# EAGLE design Dual Motor Driver (EAGLE 6.5.0)
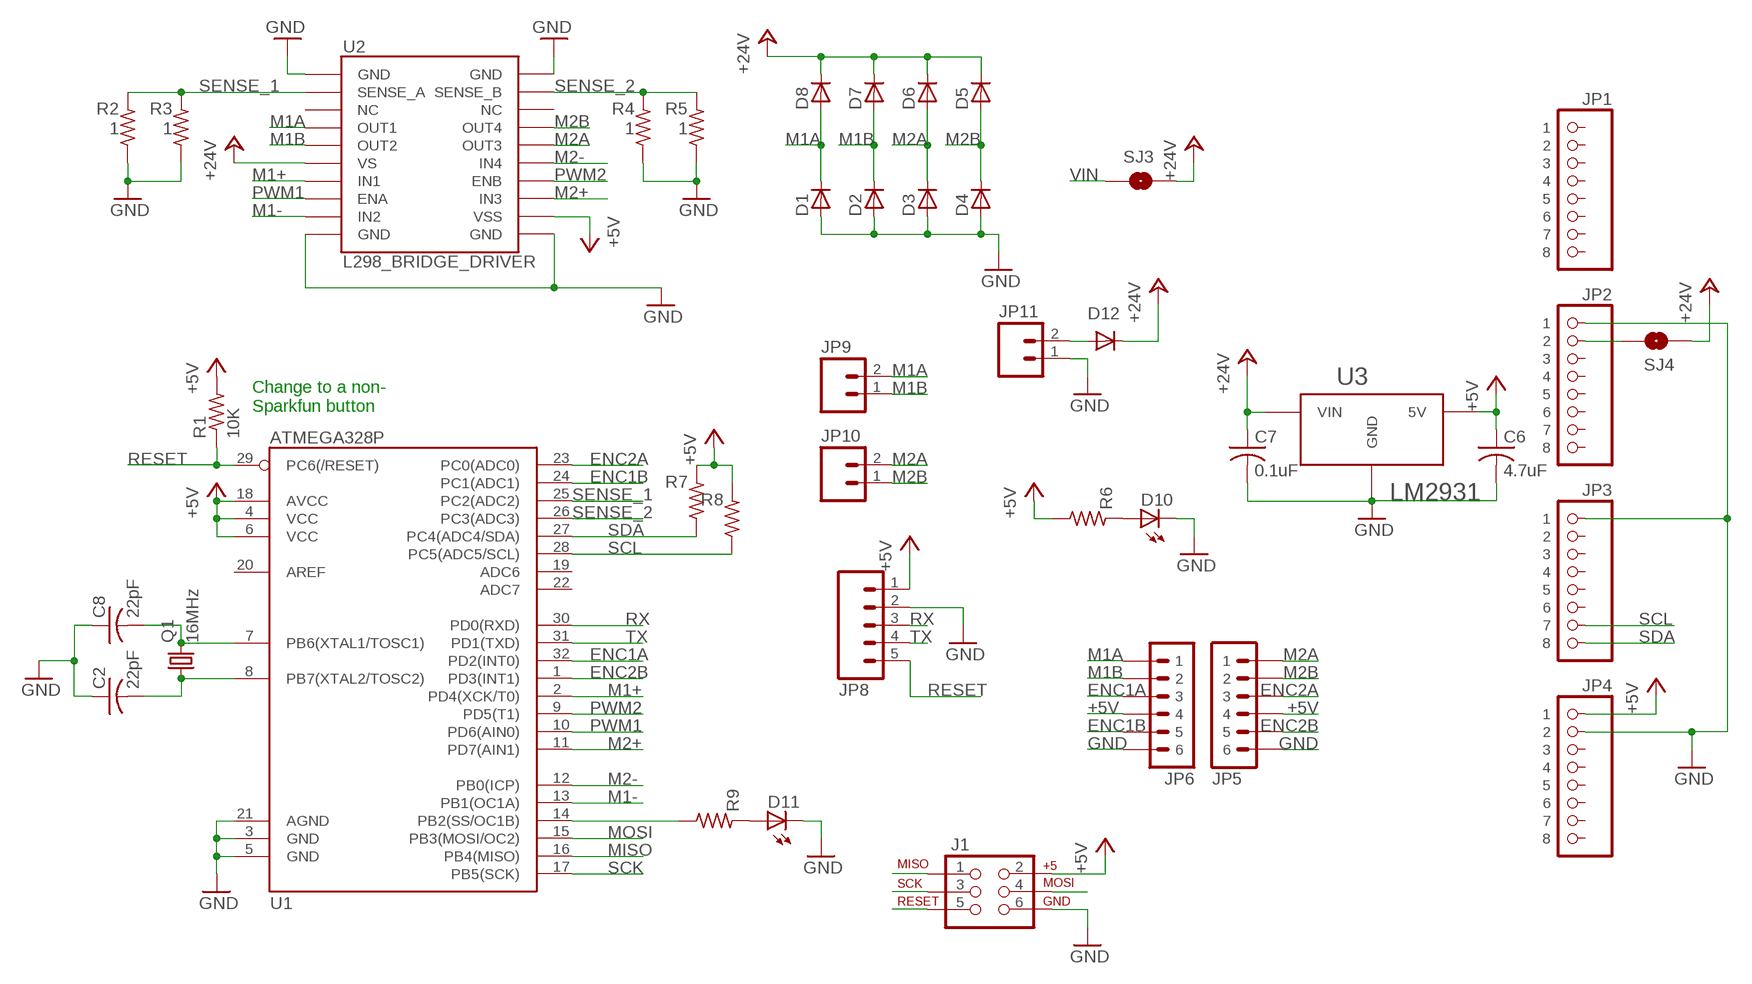
[diagram p0: schematic, sheet 1]

## Parts
C2  22pF  C-USC0603  [C0603]
C6  4.7uF  C-USC0603  [C0603]
C7  0.1uF  C-USC0603  [C0603]
C8  22pF  C-USC0603  [C0603]
D1  D-SOD123  [SOD123]
D2  D-SOD123  [SOD123]
D3  D-SOD123  [SOD123]
D4  D-SOD123  [SOD123]
D5  D-SOD123  [SOD123]
D6  D-SOD123  [SOD123]
D7  D-SOD123  [SOD123]
D8  D-SOD123  [SOD123]
D10  LED-GREENLED-0805_NO_SILK  [LED-0805]
D11  LED-GREENLED-0805_NO_SILK  [LED-0805]
D12  DIODESMB  [SMB-DIODE]
J1  AVR_SPI_PRG_62X3_LOCK  [2X3_LOCK]
JP1  8-PIN_HEADER  [8-PIN_RECEPTACLE_LOCK_NO-SS]
JP2  8-PIN_HEADER  [8-PIN_RECEPTACLE_LOCK_NO-SS]
JP3  8-PIN_HEADER  [8-PIN_RECEPTACLE_LOCK_NO-SS]
JP4  8-PIN_HEADER  [8-PIN_RECEPTACLE_LOCK_NO-SS]
JP5  6PIN-SH_RIGHT_ANGLE  [6PIN-SH_SERIES_RA]
JP6  6PIN-SH_RIGHT_ANGLE  [6PIN-SH_SERIES_RA]
JP8  M05PTH  [1X05]
JP9  M02PTH  [1X02]
JP10  M02PTH  [1X02]
JP11  M02PTH  [1X02]
Q1  16MHz  CRYSTALCTS406  [CTS406]
R1  10K  R-US_R0603  [R0603]
R2  1  R-US_R0603  [R0603]
R3  1  R-US_R0603  [R0603]
R4  1  R-US_R0603  [R0603]
R5  1  R-US_R0603  [R0603]
R6  R-US_R0603  [R0603]
R7  R-US_R0603  [R0603]
R8  R-US_R0603  [R0603]
R9  R-US_R0603  [R0603]
SJ3  SOLDERJUMPERNC  [SJ_2S]
SJ4  SOLDERJUMPERTRACE  [SJ_2S-TRACE]
U1  ATMEGA328P  ATMEGA328_SMT  [TQFP32-08]
U2  L298_BRIDGE_DRIVER  [POWERSO20]
U3  LM2931  [TO263]

## Nets
+5V: C6.1 J1.2 JP4.P$1 JP5.P$4 JP6.P$4 JP8.1 R1.2 R6.1 R7.2 R8.2 U1.4(VCC) U1.6(VCC) U1.18(AVCC) U2.12(VSS) U3.P$3(5V)
+24V: C7.1 D5.1(C) D6.1(C) D7.1(C) D8.1(C) D12.C SJ3.2 SJ4.1 U2.6(VS) U3.P$2(VIN)
ENC1A: JP6.P$3 U1.32(PD2(INT0))
ENC1B: JP6.P$5 U1.24(PC1(ADC1))
ENC2A: JP5.P$3 U1.23(PC0(ADC0))
ENC2B: JP5.P$5 U1.1(PD3(INT1))
GND: C2.1 C6.2 C7.2 C8.1 D1.2(A) D2.2(A) D3.2(A) D4.2(A) D10.2(C) D11.2(C) J1.6 JP2.P$1 JP3.P$1 JP4.P$2 JP5.P$6 JP6.P$6 JP8.2 JP11.1 R2.1 R3.1 R4.1 R5.1 U1.3(GND) U1.5(GND) U1.21(AGND) U2.1(GND) U2.10(GND) U2.11(GND) U2.20(GND) U3.P$1(GND)
M1+: U1.2(PD4(XCK/T0)) U2.7(IN1)
M1-: U1.13(PB1(OC1A)) U2.9(IN2)
M1A: D1.1(C) D8.2(A) JP6.P$1 JP9.2 U2.4(OUT1)
M1B: D2.1(C) D7.2(A) JP6.P$2 JP9.1 U2.5(OUT2)
M2+: U1.11(PD7(AIN1)) U2.13(IN3)
M2-: U1.12(PB0(ICP)) U2.15(IN4)
M2A: D3.1(C) D6.2(A) JP5.P$1 JP10.2 U2.16(OUT3)
M2B: D4.1(C) D5.2(A) JP5.P$2 JP10.1 U2.17(OUT4)
MISO: J1.1 U1.16(PB4(MISO))
MOSI: J1.4 U1.15(PB3(MOSI/OC2))
N$1: D10.1(A) R6.2
N$2: D11.1(A) R9.2
N$4: R9.1 U1.14(PB2(SS/OC1B))
N$5: JP2.P$2 SJ4.2
N$6: C8.2 Q1.3 U1.7(PB6(XTAL1/TOSC1))
N$7: C2.2 Q1.1 U1.8(PB7(XTAL2/TOSC2))
PWM1: U1.10(PD6(AIN0)) U2.8(ENA)
PWM2: U1.9(PD5(T1)) U2.14(ENB)
RESET: J1.5 JP8.5 R1.1 U1.29(PC6(/RESET))
RX: JP8.3 U1.30(PD0(RXD))
SCK: J1.3 U1.17(PB5(SCK))
SCL: JP3.P$7 R8.1 U1.28(PC5(ADC5/SCL))
SDA: JP3.P$8 R7.1 U1.27(PC4(ADC4/SDA))
SENSE_1: R2.2 R3.2 U1.25(PC2(ADC2)) U2.2(SENSE_A)
SENSE_2: R4.2 R5.2 U1.26(PC3(ADC3)) U2.19(SENSE_B)
TX: JP8.4 U1.31(PD1(TXD))
VIN: D12.A JP11.2 SJ3.1
Unconnected: JP1.P$1 JP1.P$2 JP1.P$3 JP1.P$4 JP1.P$5 JP1.P$6 JP1.P$7 JP1.P$8 JP2.P$3 JP2.P$4 JP2.P$5 JP2.P$6 JP2.P$7 JP2.P$8 JP3.P$2 JP3.P$3 JP3.P$4 JP3.P$5 JP3.P$6 JP4.P$3 JP4.P$4 JP4.P$5 JP4.P$6 JP4.P$7 JP4.P$8 U1.19(ADC6) U1.20(AREF) U1.22(ADC7) U2.3(NC) U2.18(NC)

## Notes on the sheet
- Change to a non-
  Sparkfun button

## Library data of the parts
C2 C6-C8 = resistor:C-US: CAPACITOR, American symbol
D1-D8 = semicon-smd-ipc:D-: DIODE unfilled; PART#: CDBW140-G
D10 D11 = SparkFun-LED:LED-GREEN: Various green LEDs 0603- DIO-00821 LARGE- DIO-00862 LILYPAD- DIO-09910
D12 = SparkFun-DiscreteSemi:DIODE: Diode These are standard reverse protection diodes and small signal diodes. SMA package can handle up to about 1A. SOD-323 can handle about 200mA. What the SOD-323 package when ordering, there are some mfgs out there that are 5-pin packages.
J1 = SparkFun-Connectors:AVR_SPI_PRG_6: AVR ISP 6 Pin This is the reduced ISP connector for AVR programming. Common on Arduino. This footprint will take up less PCB space and can be used with a 10-pin to 6-pin adapter such as SKU: BOB-08508
JP1-JP4 = My Parts:8-PIN_HEADER
JP5 JP6 = con-jst:6PIN-SH; PART#: SM06B-SRSS-TB(LF)(SN)
JP8 = SparkFun-Connectors:M05: Header 5 Standard 5-pin 0.1" header. Use with straight break away headers (SKU : PRT-00116), right angle break away headers (PRT-00553), swiss pins (PRT-00743), machine pins (PRT-00117), and female headers (PRT-00115). Molex polarized connector foot print use with SKU : PRT-08230 with associated crimp pins and housings.
JP9-JP11 = SparkFun-Connectors:M02: Header 2 Standard 2-pin 0.1" header. Use with straight break away headers (SKU : PRT-00116), right angle break away headers (PRT-00553), swiss pins (PRT-00743), machine pins (PRT-00117), and female headers (PRT-00115). Molex polarized connector foot print use with SKU : PRT-08233 with associated crimp pins and housings.
Q1 = crystal:CRYSTAL: CRYSTAL; OC_FARNELL: unknown; OC_NEWARK: unknown; PART#: 406C35D16M00000
R1-R9 = resistor:R-US_: RESISTOR, American symbol
SJ3 SJ4 = SparkFun-Passives:SOLDERJUMPER: Solder Jumper Standard SMD solder jumper. Used to automate production. Two varients : Normally Open and Normally Closed are the same, but have different paste layers. NC will have a large amount of paste and should jumper during reflow.
U1 = SparkFun-DigitalIC:ATMEGA328_SMT: 32-Pin Atmega328 part Commonly used on Arduino compatible boards Available in QFP and QFN packages TQFP is IC-09069 QFN is non-stock; PROD_ID: IC-09069
U2 = SparkFun-PowerIC:L298_BRIDGE_DRIVER: Full-bridge power driver IC
U3 = on-semiconductor:LM2931

## Board
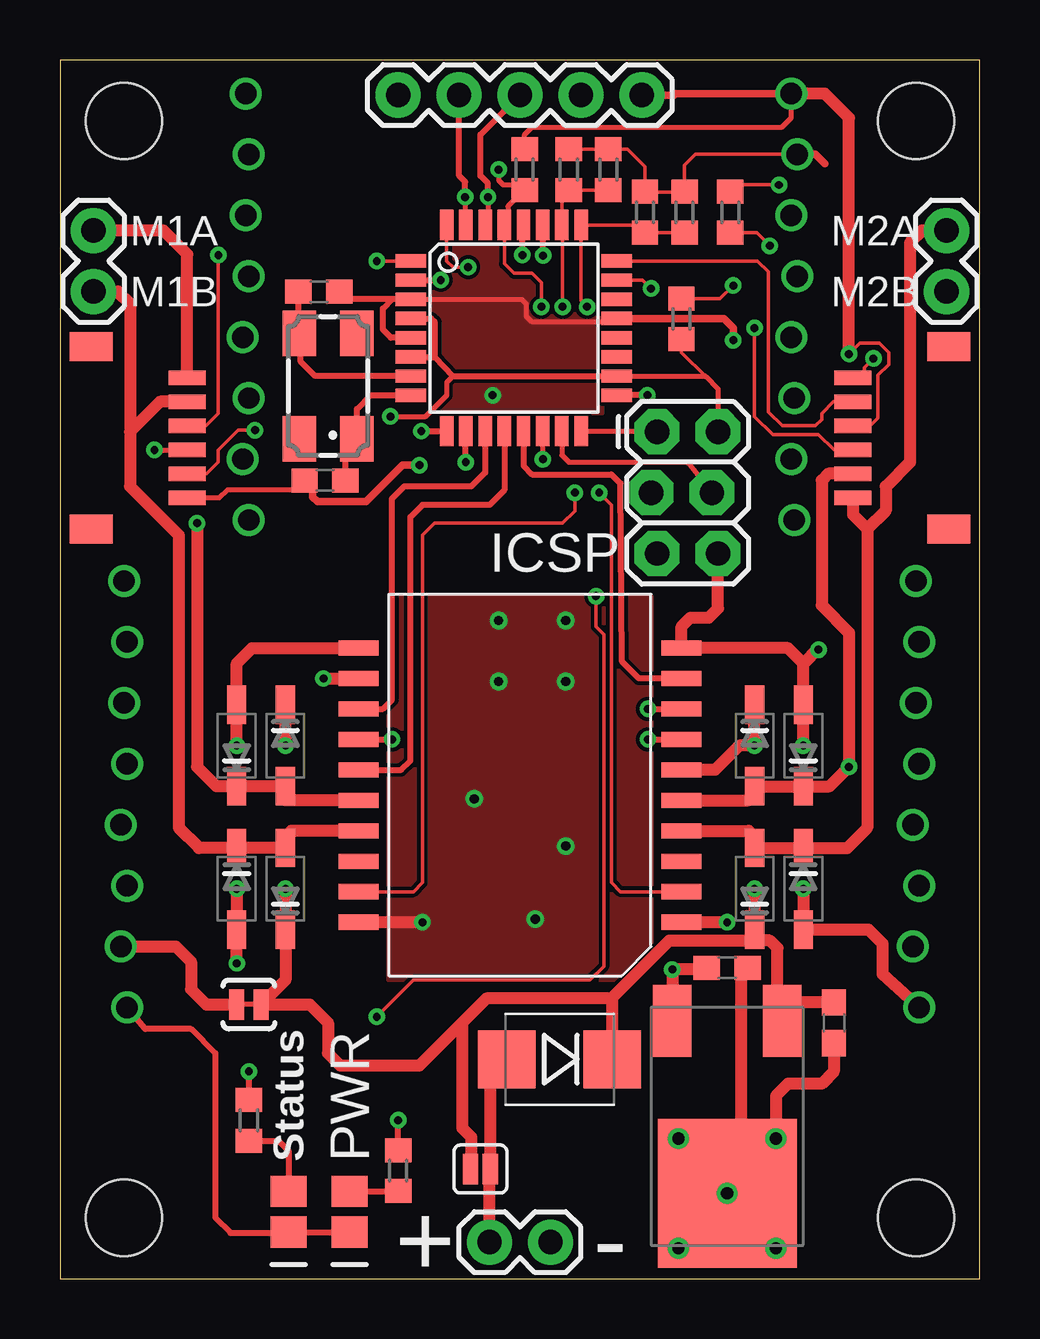
[diagram p1: board, top side]
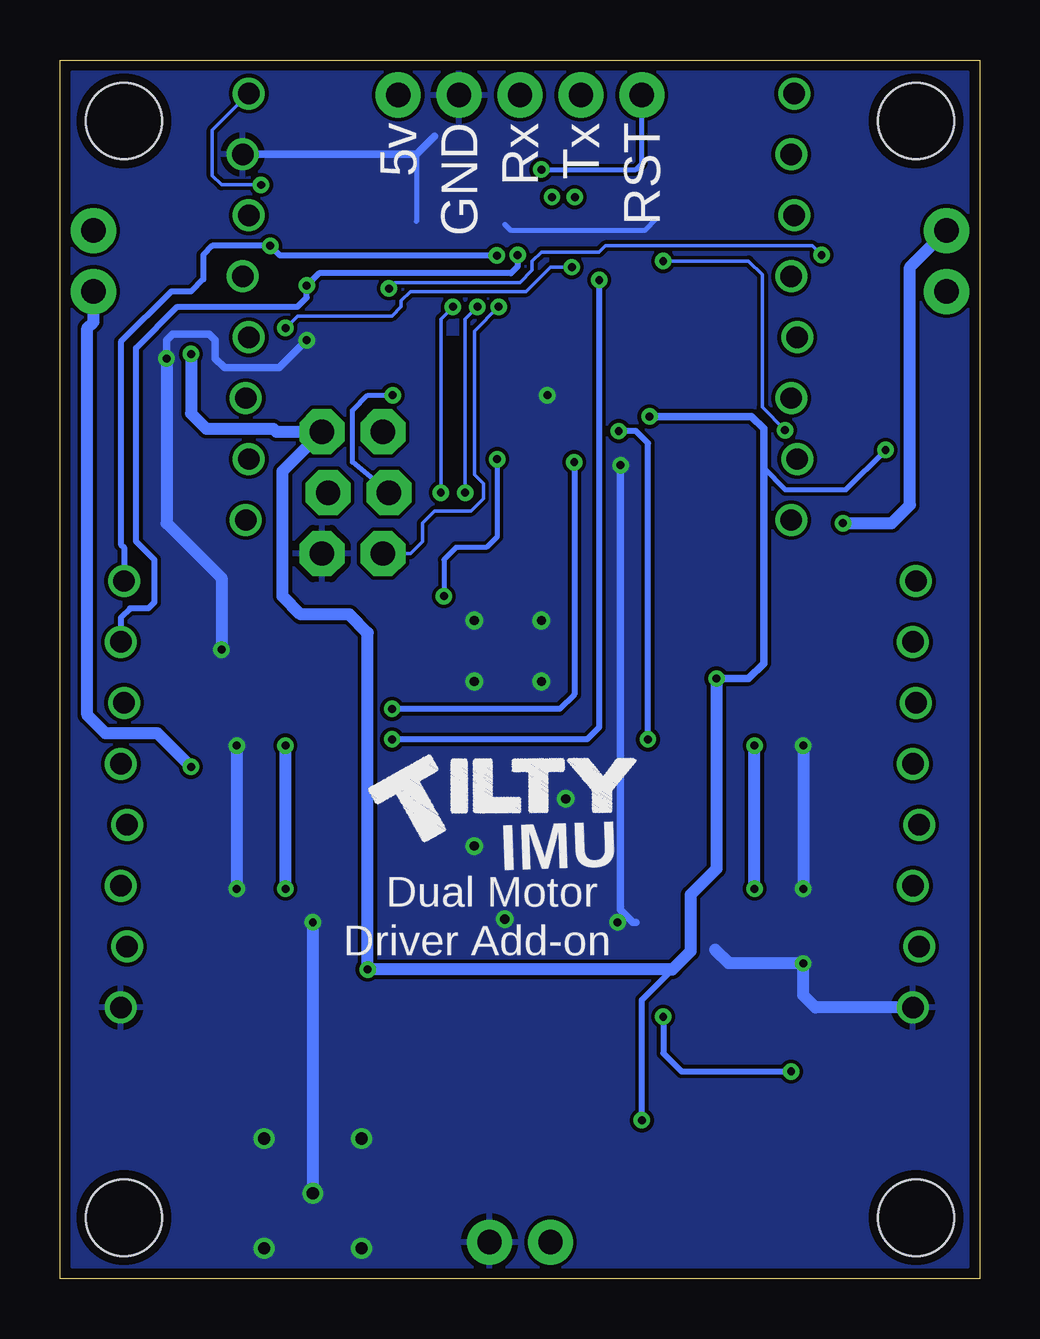
[diagram p2: board, bottom side, seen from below]

Size 38.35 x 50.8 mm. Coordinates in mm from the lower left corner, seen from the top.
Outline: 0,0 38.35,0 38.35,50.8 0,50.8 0,0
Copper layers (1*16): Top 0.0356mm / dielectric 1.5011mm / Bottom 0.0356mm
Design rules "LaenPCBOrder": minimum track width 6mil, minimum drill 13mil, track to track 6mil, track to pad 6mil, pad to pad 6mil, via to via 6mil, smd to smd 6mil, copper to edge 15mil, drill to drill 6mil, minimum pad ring 7mil, minimum via ring 7mil, stop-mask expansion 4mil, vias tented up to drill 0mil, thermal gap 10mil
Holes 3.17 mm at 2.67,2.54 35.69,2.54 35.69,48.26 2.67,48.26

### Footprints (pad centres in the part's own frame; a part is rotated, then mirrored left to right if it is on the bottom)
C0603 = smd 1.1 x 1: 1 -0.85,0; 2 0.85,0
SOD123 = smd 1.6 x 0.8: 1 -1.7,0; 2 1.7,0
LED-0805 = smd 1.3 x 1.5: 1 -0.85,0; 2 0.85,0
SMB-DIODE = smd 2.4 x 2.4: A 2.2,0; C -2.2,0
2X3_LOCK = drill 1.016 pad 1.88 octagon: 1 0,0; 2 0,2.54; 3 2.54,-0.254; 4 2.54,2.286; 5 5.08,0; 6 5.08,2.54
8-PIN_RECEPTACLE_LOCK_NO-SS = drill 0.889: P$1 -8.89,-0.127; P$2 -6.35,0.127; P$3 -3.81,-0.127; P$4 -1.27,0.127; P$5 1.27,-0.127; P$6 3.81,0; P$7 6.35,-0.127; P$8 8.89,0
6PIN-SH_SERIES_RA = smd 0.6 x 1.55: P$1 -2.5,2.125; P$2 -1.5,2.125; P$3 -0.5,2.125; P$4 0.5,2.125; P$5 1.5,2.125; P$6 2.5,2.125 | smd 1.2 x 1.8: P$7 3.8,-1.875; P$8 -3.8,-1.875
1X05 = drill 1.016 pad 1.88: 1 0,0; 2 2.54,0; 3 5.08,0; 4 7.62,0; 5 10.16,0
1X02 = drill 1.016 pad 1.88: 1 0,0; 2 2.54,0
CTS406 = smd 1.9 x 1.4: 1 -2.2,-1.2; 2 2.2,-1.2; 3 2.2,1.2; 4 -2.2,1.2
R0603 = smd 1 x 1.1: 1 -0.85,0; 2 0.85,0
SJ_2S = smd 0.635 x 1.27: 1 -0.412,0; 2 0.412,0
SJ_2S-TRACE = smd 0.635 x 1.27: 1 -0.508,0; 2 0.508,0
TQFP32-08 = smd 1.27 x 0.559: 1 -4.293,2.8; 2 -4.293,2; 3 -4.293,1.2; 4 -4.293,0.4; 5 -4.293,-0.4; 6 -4.293,-1.2; 7 -4.293,-2; 8 -4.293,-2.8; 17 4.293,-2.8; 18 4.293,-2; 19 4.293,-1.2; 20 4.293,-0.4; 21 4.293,0.4; 22 4.293,1.2; 23 4.293,2; 24 4.293,2.8 | smd 0.559 x 1.27: 9 -2.8,-4.293; 10 -2,-4.293; 11 -1.2,-4.293; 12 -0.4,-4.293; 13 0.4,-4.293; 14 1.2,-4.293; 15 2,-4.293; 16 2.8,-4.293; 25 2.8,4.293; 26 2,4.293; 27 1.2,4.293; 28 0.4,4.293; 29 -0.4,4.293; 30 -1.2,4.293; 31 -2,4.293; 32 -2.8,4.293
POWERSO20 = smd 1.651 x 0.635: 1 -6.731,5.715; 2 -6.731,4.445; 3 -6.731,3.175; 4 -6.731,1.905; 5 -6.731,0.635; 6 -6.731,-0.635; 7 -6.731,-1.905; 8 -6.731,-3.175; 9 -6.731,-4.445; 10 -6.731,-5.715; 11 6.731,-5.715; 12 6.731,-4.445; 13 6.731,-3.175; 14 6.731,-1.905; 15 6.731,-0.635; 16 6.731,0.635; 17 6.731,1.905; 18 6.731,3.175; 19 6.731,4.445; 20 6.731,5.715
TO263 = smd 5.791 x 6.198: P$1 0,2.794 | smd 1.6 x 2.997: P$2 -2.286,-4.394; P$3 2.286,-4.394

### Placement (x,y rotation side)
C2  11.05,33.27 0 top
C6  27.81,12.95 0 top
C7  32.26,10.67 270 top
C8  10.79,41.15 180 top
D1  30.99,16.26 270 top
D2  30.99,22.23 90 top
D3  7.37,22.23 90 top
D4  7.37,16.26 270 top
D5  9.4,16.26 90 top
D6  9.4,22.23 270 top
D7  28.96,22.23 270 top
D8  28.96,16.26 90 top
D10  12.06,2.79 270 top
D11  9.53,2.79 270 top
D12  20.83,9.14 180 top
J1  24.89,35.31 270 top
JP1  7.75,40.51 90 top
JP2  2.67,20.19 90 top
JP3  35.69,20.19 90 top
JP4  30.61,40.51 270 top
JP5  3.18,35.05 270 top
JP6  35.18,35.05 90 top
JP8  24.26,49.34 180 top
JP9  36.96,41.15 90 top
JP10  1.4,41.15 90 top
JP11  20.45,1.52 180 top
Q1  11.18,37.21 90 top
R1  19.37,46.23 90 top
R2  24.38,44.45 270 top
R3  26.04,44.45 270 top
R4  22.86,46.23 270 top
R5  21.21,46.23 270 top
R6  14.1,4.51 270 top
R7  27.94,44.45 90 top
R8  25.91,40.01 270 top
R9  7.87,6.6 270 top
SJ3  17.53,4.57 180 top
SJ4  7.87,11.43 180 top
U1  18.92,39.62 0 top
U2  19.18,20.57 180 top
U3  27.81,6.35 180 top

### Tracks (layer width: path | path; a pad name or v marks a point on that pad's centre or on a via)
+5V  (via drill 0.33)
  Top 0.152: R8.2 25.91,38.61 26.92,37.59 | v29.97,45.59 28.23,45.59 R7.2 | v32.89,38.54 33.34,38.99 34.16,38.99 34.54,38.61 34.54,38.1 34.1,37.66 34.1,35.88 33.78,35.56 33.06,35.56 JP6.P$4
  Top 0.203: U1.18 26.89,37.62 26.92,37.59 27.43,37.08 J1.2 | v13.78,35.94 15.24,35.94 16.13,36.83 16.13,37.36 16.38,37.62 | R1.2 19.37,47.69 19.68,48.01 30.1,48.01 30.48,48.39 JP4.P$1 | v3.94,34.54 5.3,34.54 JP5.P$4
  Top 0.254: U1.6 15.63,38.42 | 15.63,38.42 16.38,37.62 23.21,37.62 U1.18 | U1.4 15.47,40.02 15.63,39.87 15.63,38.42 | U3.P$3 25.53,11.18 26.04,11.68 | R6.1 v14.1,6.6
  Top 0.318: JP4.P$1 25.65,49.4 25.59,49.34 JP8.1
  Top 0.508: U3.P$3 v25.53,12.89 25.55,12.91 26.92,12.91 C6.1 | v32.89,38.54 32.89,48.39 31.88,49.4 JP4.P$1 | v10.99,25.02 U2.12
  Bottom 0.152: v29.97,45.59 31.62,45.59 32,45.97 32,47.88 JP4.P$1
  Bottom 0.203: 9.02,35.43 9.02,33.78 8.13,32.89 5.59,32.89 v3.94,34.54
  Bottom 0.254: v14.1,6.6 14.1,11.62 12.73,12.99
  Bottom 0.318: v13.78,35.94 9.53,35.94 9.02,35.43 9.02,25.65 9.65,25.02 v10.99,25.02
  Bottom 0.508: v32.89,38.54 32.89,36.07 32.26,35.43 29.46,35.43 29.34,35.31 J1.2 29.08,33.66 29.08,28.45 28.32,27.69 26.29,27.69 25.53,26.92 v25.53,12.89 12.83,12.89 12.73,12.99 12.06,13.65 12.06,16 10.99,17.08 v10.99,25.02
+24V  (via drill 0.33)
  Top 0.508: v9.4,22.23 D6.1 | v9.4,16.26 D5.1 9.4,12.45 SJ4.1 10.41,11.43 11.18,10.67 11.18,9.4 11.68,8.89 14.99,8.89 16.76,10.67 | v28.96,16.26 D8.1 | D7.1 v28.96,22.23 28.32,22.23 27.3,21.21 U2.6 | D8.1 28.96,14.1 | 28.96,14.1 25.4,14.1 23.03,11.72 D12.C 23.03,11.52 22.86,11.68 17.78,11.68 16.76,10.67 | 28.96,14.1 29.02,14.03 | 29.02,14.03 29.02,14.49 D8.1 | 30.1,11.43 30.1,11.68 30.11,11.69 30.11,11.93 29.91,12.13 29.91,13.78 29.59,14.1 29.08,14.1 29.02,14.03 | 30.1,11.43 U3.P$2 30.05,10.79 | 17.08,4.61 SJ3.2 17.14,4.6 17.14,5.91 16.76,6.29 16.76,10.67 | C7.1 30.19,11.52 30.1,11.43
  Bottom 0.508: v9.4,16.26 v9.4,22.23 | v28.96,16.26 v28.96,22.23
ENC1A  (via drill 0.33)
  Top 0.152: JP6.P$3 32.25,34.55 31.62,35.18 29.72,35.18 28.96,35.94 v28.96,39.62 | U1.32 16.12,42.42 16.38,42.16 v17.02,42.16
  Bottom 0.152: v28.96,39.62 28.45,40.13 24.51,40.13 24.13,40.51 24.13,40.77 23.75,41.15 18.92,41.15 17.91,42.16 v17.02,42.16
ENC1B
  Top 0.152: U1.24 29.08,42.42 29.53,41.97 29.53,36.13 30.11,35.55 30.11,35.56 31.5,35.56 31.75,35.81 31.75,36.07 32.23,36.55 JP6.P$5
ENC2A  (via drill 0.33)
  Top 0.152: U1.23 24.29,41.62 v24.64,41.27 | v6.6,42.67 6.6,36.07 6.1,35.56 JP5.P$3
  Bottom 0.152: v24.64,41.27 24.38,41.53 19.18,41.53 18.67,42.04 18.67,42.42 18.29,42.8 15.88,42.8 15.62,43.05 6.99,43.05 v6.6,42.67
ENC2B  (via drill 0.33)
  Top 0.152: v13.21,42.42 U1.1 | v8.13,35.37 7.43,35.37 6.6,34.54 6.6,34.04 6.12,33.55 JP5.P$5
  Bottom 0.152: v13.21,42.42 9.65,42.42 9.08,41.85 9.08,36.32 v8.13,35.37
GND  (via drill 0.33, 0.38, 0.51)
  Top 0.152: JP4.P$2 26.48,46.86 26.04,46.42 R3.1 R2.1 24.38,46.35 23.66,47.08 R4.1 R5.1 | v33.91,38.35 33.53,37.97 33.53,37.59 33.09,37.59 JP6.P$6
  Top 0.203: U1.21 22.88,40.02 22.73,39.88 19.68,39.88 19.43,40.13 19.43,40.64 19.25,40.82 U1.3 | JP5.P$6 6.64,32.55 6.99,32.89 9.82,32.89 C2.1 | 11.43,41.36 C8.1
  Top 0.254: U1.3 13.84,40.82 | 13.84,40.82 11.84,40.82 C8.1 | U1.5 13.8,39.22 13.46,39.56 13.46,40.44 13.84,40.82 | JP2.P$1 3.56,10.41 5.46,10.41 6.48,9.4 6.48,2.54 7.11,1.91 9.49,1.91 D11.2 D10.2
  Top 0.318: U1.21 27.67,40.02 28.07,39.62 v28.07,39.12 | JP4.P$2 31.5,46.86 31.88,46.48 | v14.99,33.91 14.29,33.91 12.76,32.38 10.73,32.38 10.54,32.58 10.54,32.93 C2.1
  Top 0.508: v7.37,16.26 D4.2 v7.37,13.14 | v7.37,22.23 D3.2 7.37,25.65 8,26.29 U2.11 | v30.99,16.26 D1.2 33.7,14.56 34.29,13.97 34.29,12.7 JP3.P$1 | v30.99,22.23 D2.2 30.99,25.65 | 25.27,6.35 25.27,6.1 U3.P$1 | v29.84,1.27 29.84,1.52 U3.P$1 | v25.78,1.27 25.78,1.52 U3.P$1 | U3.P$1 25.78,5.59 v25.78,5.84 v29.84,5.84 29.84,7.62 30.35,8.13 31.75,8.13 32.26,8.64 C7.2 | v27.81,14.86 U2.1 | 30.99,25.65 30.35,26.29 U2.10 25.91,27.18 26.29,27.56 27.05,27.56 27.43,27.94 J1.6 | v15.11,14.86 U2.20 | v31.62,26.23 31.62,26.29 30.99,25.65 | C6.2 28.66,12.91 28.38,12.64 28.38,4.13 U3.P$1
  Bottom 0.203: 19.81,43.94 19.56,43.69 13.97,43.69 13.46,44.2 | 23.5,46.86 23.5,44.07
  Bottom 0.318: v28.07,39.12 29.21,37.97 31.5,37.97 31.88,38.35 31.88,39.12 32.13,39.37 33.66,39.37 33.91,39.12 v33.91,38.35 | 14.35,14.86 14.48,14.86 14.99,15.37 v14.99,33.91 | 22.73,47.62 23.5,46.86 JP4.P$2
  Bottom 0.508: v7.37,22.23 v7.37,16.26 | v30.99,22.23 v30.99,16.26 | v27.81,14.86 U3.P$1 | JP2.P$1 6.86,11.3 7.37,11.81 v7.37,13.14 10.48,13.14 11.05,13.72 | v33.91,38.35 33.91,31.5 31.62,29.21 v31.62,26.23
  other vias: 27.81,3.56 21.08,27.43 18.29,27.43 18.29,24.89 21.08,24.89 21.08,18.03 19.81,14.99 18.03,36.83 17.27,20
  pour Top: 13.72,28.45 24.64,28.45 24.64,13.72 23.62,12.45 13.72,12.45
  pour Bottom: 37.85,39.12 37.08,39.12 37.08,25.15 32.77,25.15 32.77,39.37 18.03,39.37 18.03,44.2 37.85,44.2
  pour Bottom: 17.78,39.12 17.78,43.18 17.78,44.45 23.11,39.12
  pour Bottom: 0.51,0.51 37.85,0.51 37.85,50.29 0.51,50.29
  pour Top: 15.49,43.18 22.61,43.18 22.61,36.07 15.49,36.07
M1+  (via drill 0.33)
  Top 0.254: U1.2 15.87,41.62 v15.88,41.63 | v24.51,22.48 U2.7
  Bottom 0.254: v15.88,41.63 15.88,22.99 16.38,22.48 v24.51,22.48
M1-
  Top 0.254: U2.9 24.13,25.02 23.43,25.72 23.37,33.15 22.99,33.53 19.68,33.53 19.32,33.89 U1.13
M1A
  Top 0.508: U2.4 28.7,18.67 28.83,18.54 28.83,18.08 D8.2 D1.1 32.81,17.96 33.66,18.8 33.66,31.24 | 33.66,31.24 34.42,32 34.42,33.02 35.43,34.04 35.43,43.18 35.94,43.69 JP9.2 | JP6.P$1 33.05,31.84 33.66,31.24
M1B  (via drill 0.33)
  Top 0.508: U2.5 28.7,19.94 28.83,20.07 28.83,20.4 D7.2 D2.1 32.08,20.52 v32.89,21.34 32.89,26.92 31.75,28.07 31.75,33.27 32.03,33.55 JP6.P$2
  Bottom 0.508: JP9.1 36.96,39.88 37.21,39.62 37.21,23.5 36.45,22.73 34.29,22.73 v32.89,21.34
M2+
  Top 0.254: U2.13 13.46,23.75 13.84,24.13 13.84,32.51 14.35,33.02 17.14,33.02 17.72,33.6 U1.11
M2-
  Top 0.254: U2.15 14.22,21.21 14.61,21.59 14.61,31.75 15.11,32.26 17.91,32.26 18.52,32.87 U1.12
M2A  (via drill 0.33)
  Top 0.508: U2.16 9.4,19.94 9.27,20.07 9.27,20.4 D6.2 D3.1 6.53,20.52 5.71,21.34 v5.71,31.5 | JP5.P$1 5.31,42.7 4.32,43.69 JP10.2
  Bottom 0.508: v5.71,31.5 3.68,31.5 2.92,32.26 2.92,42.16 JP10.2
M2B
  Top 0.508: U2.17 9.65,18.67 9.53,18.54 9.53,18.08 D5.2 D4.1 5.79,17.96 4.95,18.8 4.95,30.99 2.92,33.02 2.92,35.31 | JP10.1 2.41,41.15 2.92,40.64 2.92,35.31 | JP5.P$2 4.17,36.55 2.92,35.31
MISO
  Top 0.203: J1.1 21.75,35.31 U1.16
MOSI
  Top 0.203: U1.15 20.92,34.32 21.21,34.04 26.16,34.04 J1.4
N$1
  Top 0.254: D10.1 14.08,3.64 R6.2
N$2
  Top 0.254: R9.2 9.11,5.75 9.53,5.33 D11.1
N$3
  cutout Bottom: 20.07,42.67 29.21,42.67 29.59,43.05 32,43.05 32.38,42.67 32.38,41.66 32.89,41.15 33.72,41.15 35.81,39.05 35.81,30.54 35.69,30.42 35.69,27.69 35.81,27.56 35.81,26.67 35.81,27.56 35.43,27.94 34.67,27.94 34.42,28.19 34.42,29.97 35.18,30.73 35.18,38.8 33.46,40.51 28.45,40.51 28.07,40.89 28.07,41.4 27.56,41.91 19.56,41.91 19.3,42.16 19.3,42.67
N$4  (via drill 0.33)
  Top 0.152: v22.35,28.45 22.35,27.18 22.67,26.86 22.67,13.02 22.1,12.45 14.73,12.45 v13.21,10.92
  Top 0.203: v20.13,34.16 U1.14
  Top 0.254: v7.87,8.64 R9.1
  Bottom 0.203: v20.13,34.16 20.13,30.92 20.57,30.48 21.84,30.48 22.35,29.97 v22.35,28.45
  Bottom 0.254: v13.21,10.92 13.21,9.4 12.45,8.64 v7.87,8.64
N$5
  Top 0.508: JP2.P$2 4.83,13.84 5.46,13.21 5.46,12.06 6.1,11.43 SJ4.2
N$6
  Top 0.254: C8.2 9.95,39.41 Q1.3 10.03,39.35 10.03,38.23 10.64,37.62 U1.7
N$7
  Top 0.254: Q1.1 12.41,35.01 | Q1.1 12.38,36.25 12.95,36.83 U1.8 | C2.2 11.9,34.53 Q1.1
PWM1  (via drill 0.33)
  Top 0.254: v16.92,34.04 U1.10 | v24.51,23.75 U2.8
  Bottom 0.254: v16.92,34.04 16.92,24.36 17.53,23.75 v24.51,23.75
PWM2  (via drill 0.33)
  Top 0.254: v15.06,35.33 U1.9 | U2.14 v13.84,22.48
  Bottom 0.254: v13.84,22.48 13.84,34.82 14.35,35.33 v15.06,35.33
RESET  (via drill 0.33)
  Top 0.152: v20.07,40.51 20.07,41.53 19.68,41.91 18.92,41.91 18.52,42.31 U1.29
  Top 0.203: U1.29 18.67,44.06 18.67,44.7 18.92,44.96 19.18,44.96 19.37,45.15 R1.1 19.15,45.59 18.48,45.59 18.29,45.78 v18.29,46.23
  Bottom 0.152: J1.5 23.75,30.23 23.24,30.73 23.24,31.5 22.73,32 21.21,32 20.7,32.51 20.7,33.15 21.08,33.53 21.08,39.5 v20.07,40.51
  Bottom 0.203: v18.29,46.23 14.35,46.23 14.1,46.48 JP8.5
RX  (via drill 0.33)
  Top 0.203: v17.84,45.09 17.84,44.04 U1.30
  Top 0.254: JP8.3 17.53,47.69 17.53,45.97 17.84,45.66 v17.84,45.09
SCK  (via drill 0.33)
  Top 0.254: v24.49,36.83 U1.17
  Bottom 0.203: J1.3 26.16,34.04 26.16,36.2 25.53,36.83 v24.49,36.83
SCL  (via drill 0.33)
  Top 0.152: R8.1 27.52,40.85 v28.07,41.4
  Top 0.254: v19.28,42.67 19.28,43.87 U1.28
  Bottom 0.254: v19.28,42.67 19.28,42.19 19.56,41.91 27.56,41.91 v28.07,41.4 28.07,40.89 28.45,40.51 33.47,40.51 35.18,38.8 35.18,30.73 34.42,29.97 34.42,28.19 34.67,27.94 35.43,27.94 35.81,27.56 JP3.P$7
SDA  (via drill 0.33)
  Top 0.152: R7.1 29.04,43.6 v29.59,43.05
  Top 0.254: v20.14,42.65 20.14,43.9 U1.27
  Bottom 0.254: v20.14,42.65 29.18,42.65 v29.59,43.05 32,43.05 32.38,42.67 32.38,41.66 32.89,41.15 33.72,41.15 35.81,39.05 35.81,30.61 35.69,30.48 JP3.P$8
SENSE_1  (via drill 0.33)
  Top 0.152: U2.2 23.37,16.13 22.99,16.51 22.99,32.26 v22.48,32.77 | v21.97,40.51 21.72,40.77 U1.25 24.32,43.92 R2.2 R3.2
  Bottom 0.152: v22.48,32.77 22.48,40.01 v21.97,40.51
SENSE_2  (via drill 0.33)
  Top 0.152: U2.19 14.73,16.13 15.11,16.51 15.11,30.99 15.62,31.5 20.95,31.5 21.46,32 v21.46,32.77 | v20.95,40.51 20.95,43.88 U1.26 20.92,45.35 R5.2 R4.2
  Bottom 0.152: v21.46,32.77 21.46,40.01 v20.95,40.51
TX  (via drill 0.33)
  Top 0.203: v16.89,45.09 16.89,43.95 U1.31
  Top 0.254: v16.89,45.09 16.89,45.72 16.64,45.97 JP8.4
VIN
  Top 0.508: 17.88,9.41 D12.A 17.94,9.47 SJ3.1 17.91,4.54 JP11.2

### Text on the board
tNames: M1A | M2A | M1B | M2B | ICSP | Status | PWR | + | -
bNames: RST | Tx | Rx | GND | 5v | IMU | Dual Motor | Driver Add-on